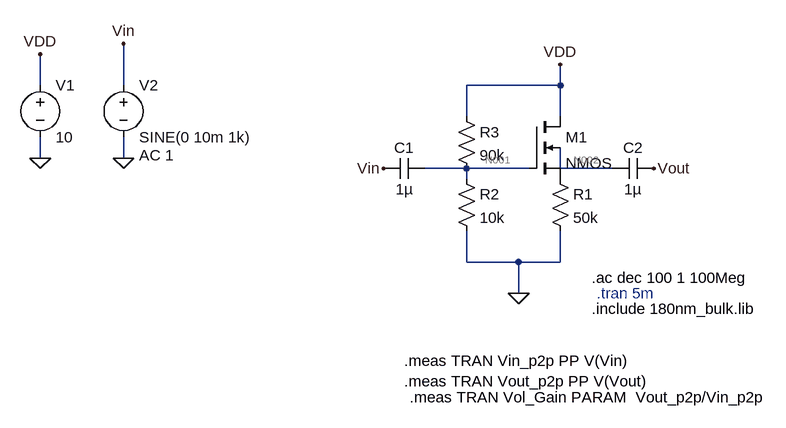
[diagram p0: schematic CD_Amp.asc]
CD_Amp.asc, the LTspice schematic file:
Version 4
SHEET 1 880 680
WIRE -496 64 -496 16
WIRE -368 64 -368 0
WIRE 304 64 304 32
WIRE 304 64 160 64
WIRE 160 112 160 64
WIRE 304 112 304 64
WIRE -496 176 -496 144
WIRE -368 176 -368 144
WIRE 160 192 96 192
WIRE 256 192 160 192
WIRE 304 192 304 160
WIRE 384 192 304 192
WIRE 160 208 160 192
WIRE 160 336 160 288
WIRE 240 336 160 336
WIRE 304 336 304 288
WIRE 304 336 240 336
WIRE 240 384 240 336
FLAG -496 176 0
FLAG -496 16 VDD
FLAG 304 32 VDD
FLAG 240 384 0
FLAG 448 192 Vout
FLAG -368 176 0
FLAG -368 0 Vin
FLAG 32 192 Vin
SYMBOL cmosn 256 112 R0
SYMATTR InstName M1
SYMATTR Value NMOS
SYMBOL res 288 192 R0
SYMATTR InstName R1
SYMATTR Value 50k
SYMBOL res 144 192 R0
SYMATTR InstName R2
SYMATTR Value 10k
SYMBOL res 144 96 R0
SYMATTR InstName R3
SYMATTR Value 90k
SYMBOL voltage -496 48 R0
WINDOW 123 0 0 Left 0
WINDOW 39 0 0 Left 0
SYMATTR InstName V1
SYMATTR Value 10
SYMBOL cap 96 176 R90
WINDOW 0 0 32 VBottom 2
WINDOW 3 32 32 VTop 2
SYMATTR InstName C1
SYMATTR Value 1µ
SYMBOL cap 448 176 R90
WINDOW 0 0 32 VBottom 2
WINDOW 3 32 32 VTop 2
SYMATTR InstName C2
SYMATTR Value 1µ
SYMBOL voltage -368 48 R0
WINDOW 123 24 124 Left 2
WINDOW 39 0 0 Left 0
SYMATTR InstName V2
SYMATTR Value SINE(0 10m 1k)
SYMATTR Value2 AC 1
TEXT 352 408 Left 2 !.include 180nm_bulk.lib
TEXT 360 384 Left 2 ;.tran 5m
TEXT 64 488 Left 2 !.meas TRAN Vin_p2p PP V(Vin)\n.meas TRAN Vout_p2p PP V(Vout)
TEXT 72 544 Left 2 !.meas TRAN Vol_Gain PARAM  Vout_p2p/Vin_p2p
TEXT 352 360 Left 2 !.ac dec 100 1 100Meg

The netlist it stands for:
* CD_Amp.asc
M1 VDD N001 P001 N002 NMOS
R1 P001 0 50k
R2 N001 0 10k
R3 VDD N001 90k
V1 VDD 0 10
C1 N001 Vin 1µ
C2 Vout N002 1µ
V2 Vin 0 SINE(0 10m 1k) AC 1
.model NMOS NMOS
.model PMOS PMOS
.lib standard.mos
.include 180nm_bulk.lib
* .tran 5m
.meas TRAN Vin_p2p PP V(Vin)
.meas TRAN Vout_p2p PP V(Vout)
.meas TRAN Vol_Gain PARAM  Vout_p2p/Vin_p2p
.ac dec 100 1 100Meg
.backanno
.end

* Results of the author's LTspice run, read from the files saved beside the schematic
* Operating Point, zero values left out:
*   V(vdd) = 10 V
*   V(n001) = 1 V
*   V(p001) = 414.9 mV
*   V(n002) = 589.9 mV
*   V(vout) = 589.9 nV
*   Id(M1) = 8.299 µA
*   Is(M1) = -8.299 µA
*   I(R1) = 8.299 µA
*   I(R2) = 100 µA
*   I(R3) = 100 µA
*   I(V1) = -108.3 µA
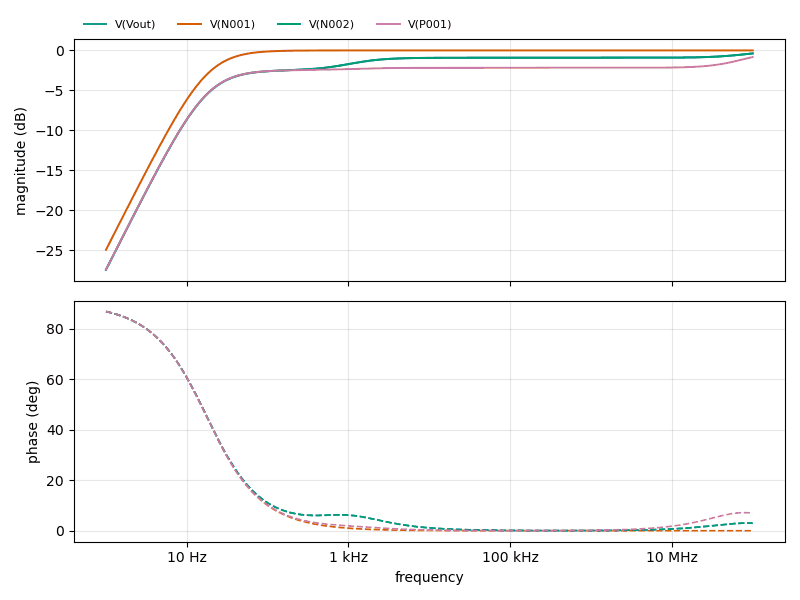
[diagram p1: AC Analysis of CD_Amp.asc, plotted from the saved traces]
* AC Analysis, 1 run:
*   V(Vout): -27.45 dB at 1 Hz, -0.38 dB at 100 MHz, peak -0.38 dB at 100 MHz, 3 dB below the peak at 36.71 Hz
*   V(N001): -24.97 dB at 1 Hz, -0.00 dB at 100 MHz, peak -0.00 dB at 100 MHz, 3 dB below the peak at 17.68 Hz
*   V(N002): -27.45 dB at 1 Hz, -0.38 dB at 100 MHz, peak -0.38 dB at 100 MHz, 3 dB below the peak at 36.71 Hz
*   V(P001): -27.43 dB at 1 Hz, -0.83 dB at 100 MHz, peak -0.83 dB at 100 MHz, 3 dB below the peak at 28.93 Hz